# Altium schematic sheet 8051_SCH.SchDoc: Microcontrolador 8051
size A4; Author: **; CompanyName: Electrónica Aplicada al Automotor; Organization: UTN FRBA; DocumentNumber: 4; Revision: 00; SheetNumber: 4; SheetTotal: 7; Autor: Badenas, Francisco J. / Ipar, Eugenia
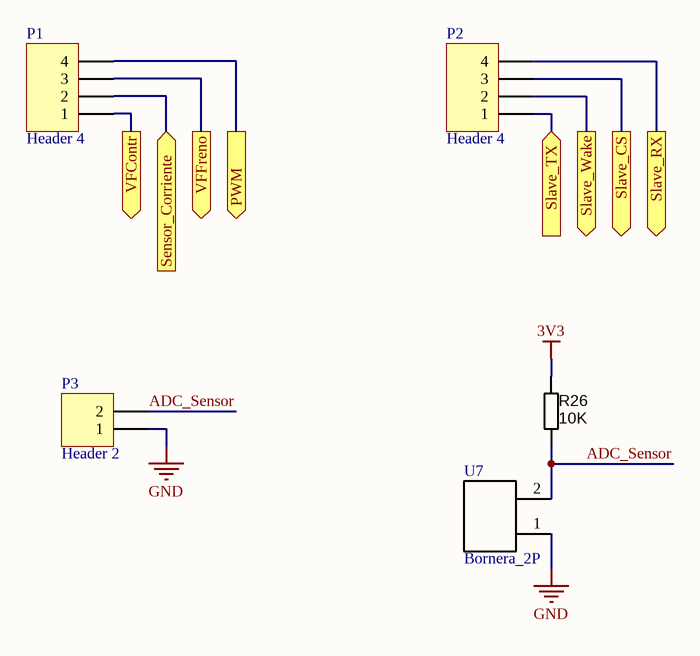
[diagram p0: 8051_SCH.SchDoc]

## Parts
P1  Header 4  [HDR1X4]
P2  Header 4  [HDR1X4]
P3  Header 2  [HDR1X2]
R26  10K  [RESC1608N_ZERO]
U7  Bornera_2P  [Bornera]

## Ports
PWM (out), Sensor_Corriente (in), Slave_CS (out), Slave_RX (out), Slave_TX (in), Slave_Wake (out), VFContr (out), VFFreno (out)

## Nets
3V3: R26.1
GND: P3.1 U7.1
ADC_Sensor: P3.2 R26.2 U7.2
PWM: P1.4 ; port PWM
Sensor_Corriente: P1.2 ; port Sensor_Corriente
Slave_CS: P2.3 ; port Slave_CS
Slave_RX: P2.4 ; port Slave_RX
Slave_TX: P2.1 ; port Slave_TX
Slave_Wake: P2.2 ; port Slave_Wake
VFContr: P1.1 ; port VFContr
VFFreno: P1.3 ; port VFFreno

## Notes on the sheet
- Title:
- Size:
- Author:
- A4
- Sheet
- of
- Revision:
- File:
- Date:

## Library data of the parts
P1 P2 = Header 4: Header, 4-Pin; LatestRevisionDate: 17-Jul-2002; LatestRevisionNote: Re-released for DXP Platform.; Publisher: Altium Limited
P3 = Header 2: Header, 2-Pin; LatestRevisionDate: 17-Jul-2002; LatestRevisionNote: Re-released for DXP Platform.; Publisher: Altium Limited
R26 = RES_0R_0603: Resistor SMD 0603 10K 5%; Manufacturer 1: Vishay/Dale; Manufacturer Part Number 1: CRCW06030000Z0EA; Ratings: 1/10W; SCDType: spec; Tolerance: ±5%; Package / Case: 0603 (1608metric); Supplier 1: Digi-Key; Supplier Part Number 1: 541-0.0GCT-ND; ComponentLink1URL: http://www.vishay.com/doc?20035; ComponentLink1Description: http://www.vishay.com/doc?20035; Supplier 2: Digi-Key; Supplier Part Number 2: P0.0GTR-ND; Manufacturer 2: Panasonic Electronic Components; Manufacturer Part Number 2: ERJ-3GEY0R00V; RoHS 2: RoHS Compliant; ComponentLink2URL: http://industrial.panasonic.com/www-cgi/jvcr13pz.cgi?E+PZ+3+AOA0001+ERJ3GEY0R00V+7+WW; ComponentLink2Description: http://industrial.panasonic.com/www-cgi/jvcr13pz.cgi?E+PZ+3+AOA0001+ERJ3GEY0R00V+7+WW; Supplier 3: Digi-Key; Supplier Part Number 3: 311-0.0LECT-ND; Manufacturer 3: Yageo; Manufacturer Part Number 3: AC0603JR-070RL; RoHS 3: RoHS Compliant; ComponentLink3URL: http://www.yageo.com/documents/recent/PYu-AC_51_RoHS_L_2.pdf; ComponentLink3Description: http://www.yageo.com/documents/recent/PYu-AC_51_RoHS_L_2.pdf; Value: 10K